# Altium schematic sheet e-Fuse.SchDoc
size A4; SheetNumber: 5; SheetTotal: 7
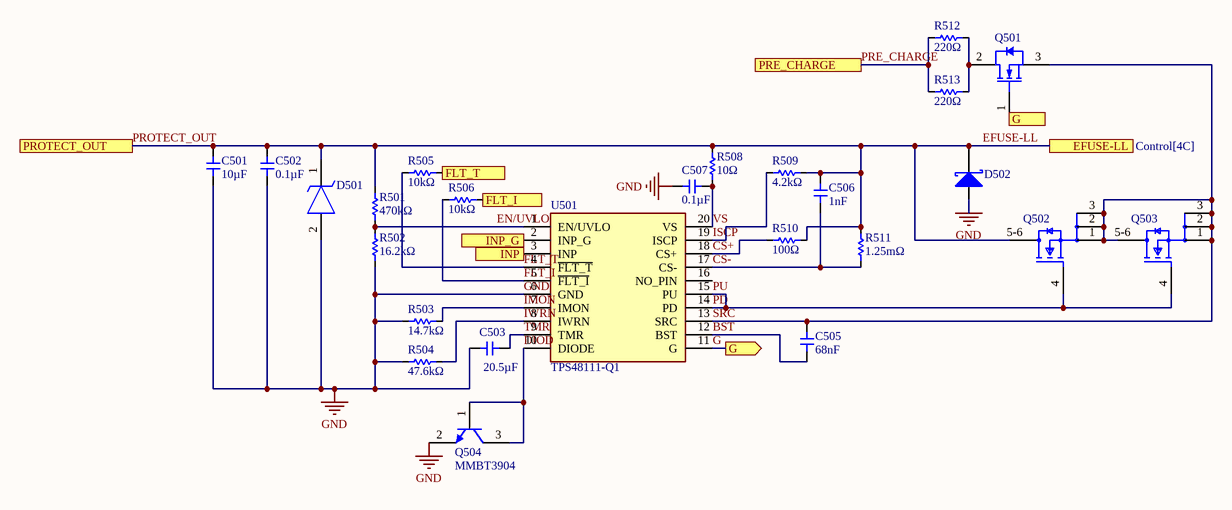
[diagram p0: e-Fuse.SchDoc]

## Parts
C501  Capacitance: 10µF  [0603]  (hidden comment: CIN)
C502  Capacitance: 0.1µF  [0603]  (hidden comment: CIN)
C503  Capacitance: 20.5µF  [1210]  (hidden comment: C(TMR))
C505  Capacitance: 68nF  [0603]  (hidden comment: CBST)
C506  Capacitance: 1nF  [0603]  (hidden comment: C(SCP))
C507  Capacitance: 0.1µF  [0603]  (hidden comment: C(TMR))
D501  SMLJ58AQ-TP  [DIOM7959X282N]  (value not drawn)
D502  DFLS1100-7  [DIOD-POWERDI123-2_V]  (value not drawn)
Q501  IPD068N10N3 G  [INF-PG-TO252-3-11_A_L]  (value not drawn)
Q502  NVMFS015N10MCLT1G  [FP-488AA-MFG]  (value not drawn)
Q503  NVMFS015N10MCLT1G  [FP-488AA-MFG]  (value not drawn)
Q504  MMBT3904  [FAIR-SOT23-3_V]
R501  Resistance: 470kΩ  [0603]  (hidden comment: R1)
R502  Resistance: 16.2kΩ  [0603]  (hidden comment: R2)
R503  Resistance: 14.7kΩ  [0603]  (hidden comment: R(IMON))
R504  Resistance: 47.6kΩ  [0603]  (hidden comment: R(IWRN))
R505  Resistance: 10kΩ  [0603]  (hidden comment: R1)
R506  Resistance: 10kΩ  [0603]  (hidden comment: R1)
R508  Resistance: 10Ω  [0603]  (hidden comment: R(ISCP))
R509  Resistance: 4.2kΩ  [0603]  (hidden comment: R(ISCP))
R510  Resistance: 100Ω  [0603]  (hidden comment: R(SET))
R511  1.25mΩ  [SMD_2512]
R512  220Ω  [SMD_2512]
R513  220Ω  [SMD_2512]
U501  TPS48111-Q1  [SOP50P490X110-20N]

## Ports
EFUSE-LL (see Control[4C]), FLT_I (out), FLT_T (out), G, G (out), INP (in), INP_G (in), PRE_CHARGE, PROTECT_OUT

## Nets
GND: C501.1 C502.1 C503.1 C507.1 D501.2(A) D502.1(A) Q504.2(E) R502.1 R503.1 R504.1 U501.6(GND)
BST: C505.1 U501.12(BST)
CS+: R510.1 U501.18(CS+)
CS-: C506.1 R511.1 U501.17(CS-)
DIOD: Q504.1(B) Q504.3(C) U501.10(DIODE)
EFUSE-LL: C501.2 C502.2 C506.2 D501.1(K) D502.2(K) Q502.5-6(D) R501.2 R508.2 R509.2 R510.2 R511.2 ; port PROTECT_OUT, port EFUSE-LL  [also labelled PROTECT_OUT]
EN/UVLO: R501.1 R502.2 U501.1(EN/UVLO)
FLT_I: R506.2 U501.5(~{FLT_I})
FLT_I: R506.1 ; port FLT_I  [a separate net that carries the same name]
FLT_T: R505.2 U501.4(~{FLT_T})
FLT_T: R505.1 ; port FLT_T  [a separate net that carries the same name]
G: Q501.1(GATE) U501.11(G) ; port G
IMON: R503.2 U501.7(IMON)
INP: U501.3(INP) ; port INP
INP_G: U501.2(INP_G) ; port INP_G
ISCP: R509.1 U501.19(ISCP)
IWRN: R504.2 U501.8(IWRN)
PD: Q502.4(G) Q503.4(G) U501.14(PD) U501.15(PU)  [also labelled PU]
PRE_CHARGE: R512.2 R513.2 ; port PRE_CHARGE
SRC: C505.2 Q501.3(SOURCE) Q502.1(S) Q502.2(S) Q502.3(S) Q503.1(S) Q503.2(S) Q503.3(S) Q503.5-6(D) U501.13(SRC)
TMR: C503.2 U501.9(TMR)
VS: C507.2 R508.1 U501.20(VS)
NetQ501_2: Q501.2(DRAIN) R512.1 R513.1

Not connected (* = marked no-connect by the designer): U501 16(NO_PIN)

## Library data of the parts
C501-C503 C505-C507 = CMP-024-000020-15: SMD type ceramic capacitor; Voltage: 50V; Design Item ID: Capacitor; Source: robit_passive.SchLib
D501 = SMLJ58AQ-TP: TVS Diode (Uni-directional); Manufacturer_Name: MCC; Datasheet Link: https://www.mccsemi.com/pdf/Products/SMLJ5.0AQ_SMLJ85CAQ(SMC).pdf; Height: 2.823mm; Manufacturer_Part_Number: SMLJ58AQ-TP
D502 = CMP-2000-05099-1: 1 A High Voltage Schottky Barrier Rectifier, 0.62 V, -55 to 175 degC, 2- Pin POWERDI123, Pb-Free, Tape and Reel; Manufacturer: Diodes Inc; Average Rectified Current-Max: 1A; Peak Current-Max: 40A; Forward Voltage: 0.77V; Reverse Current-Max: 1µA; Reverse Voltage-Max [Vrrm]: 100V; Datasheet Version: Sep-14; Datasheet URL: https://datasheet.ciiva.com/15144/getdatasheetpartid-44146-15144126.pdf; Manufacturer URL: http://www.diodes.com/
Q501 = CMP-1091-00169-1: N-Channel OptiMOS 3 Power-Transistor, 100 V VDS, 90 A ID, -55 to 175 degC, PG-TO252-3-11, Reel, Green; Manufacturer: Infineon; QG: 51Â nC; RDS (on) (max): 6.8Â mOhm; RthJC (max): 1 K/W; VGS(th) (min): 2Â V; RthJA (max): 62 K/W; VDS (max): 100Â V; ID (max): 90Â A; Ptot (max): 150Â W; Green: TRUE; Polarity: N; VGS(th) (max): 3.5Â V; Rth: 1Â K/W; IDpuls (max): 360Â A; Packing: Reel; ComponentLink1Description: Manufacturer URL; Mounting Technology: Surface Mount; ComponentLink2Description: Datasheet; PartNumber: IPD068N10N3 G; ComponentLink2URL: http://www.infineon.com/dgdl/IPD068N10N3+G_Rev2.1.pdf?folderId=db3a304313b8b5a60113cee8763b02d7&fileId=db3a30431ce5fb52011d1eb7aeb615d1; DatasheetVersion: Rev. 2.1; ComponentLink3URL: http://www.infineon.com/dgdl/IPD160N04L_rev1.0.pdf?folderId=db3a3043163797a6011643468e7505a4&fileId=db3a3043163797a60116436401cf05cf; PackageReference: PG-TO252-3-11; PackageVersion: Rev. 02, 03/2007; ComponentLink1URL: http://www.infineon.com/; PackageDescription: 3-Pin Plastic (Green) Transistor Single Outline Package, 6.57 x 6.1 mm Body, 2.29 mm Pitch; ComponentLink3Description: Package Specification
Q502 Q503 = CMP-00278-108017151-1: NVMFS015N10MCLT1G Mosfet, N-Ch, 100V, 47.1A, Dfn Rohs Compliant: Yes; Manufacturer Lifecycle Status: ACTIVE; Lifecycle Status: Production; NexarPartId: 108017151
Q504 = CMP-1670-00008-1: NPN General Purpose Amplifier, 40 V, 0.2 A, -55 to 150 degC, 3-Pin SOT23, RoHS, Tape and Reel; Tolerance: 30ppm; Capacitance: 1.8E-11 f; Frequency: 12.288 MHz; ESR: 40 Ohm; Load Capacitance: 18 pF; REACH SVHC: No SVHC; Pins: 4; ComponentLink3URL: http://www.fairchildsemi.com/dwg/MA/MA03D.pdf; PackageDescription: 3-Pin Small Outline Transistor, Body 2.92 x 1.325 mm, Pitch 0.95 mm; ComponentLink1URL: https://www.fairchildsemi.com/; Max Operating Temperature: 70degC; PackageReference: SOT23-3; ComponentLink1Description: Manufacturer URL; Width: 0.126 inch; Min Operating Temperature: -20degC; DatasheetVersion: Rev. 1.1.0, 10/2014; Mount: Surface Mount; Height: 0.041 inch; Package Quantity: 1000; Frequency Tolerance: 30ppm; Packaging: Tape and Reel; ComponentLink2URL: https://www.fairchildsemi.com/datasheets/MM/MMBT3904.pdf; RoHSCompliant: True; ComponentLink3Description: Package Specification; ComponentLink2Description: Datasheet; Length: 0.197 inch
R501-R506 R508-R510 = CMP-029-000004-8: SMD type resistor; Design Item ID: Resistor; Source: robit_passive.SchLib
R511 = Resistor: R(SNS)
R512 R513 = Resistor
U501 = TPS48111-Q1: Integrated Circuit; Manufacturer_Name: Texas Instruments; Datasheet Link: https://www.ti.com/lit/ds/slusee5c/slusee5c.pdf; Height: 1.1mm; Manufacturer_Part_Number: TPS48111-Q1